# Altium schematic sheet Generic_Module.SchDoc
size C
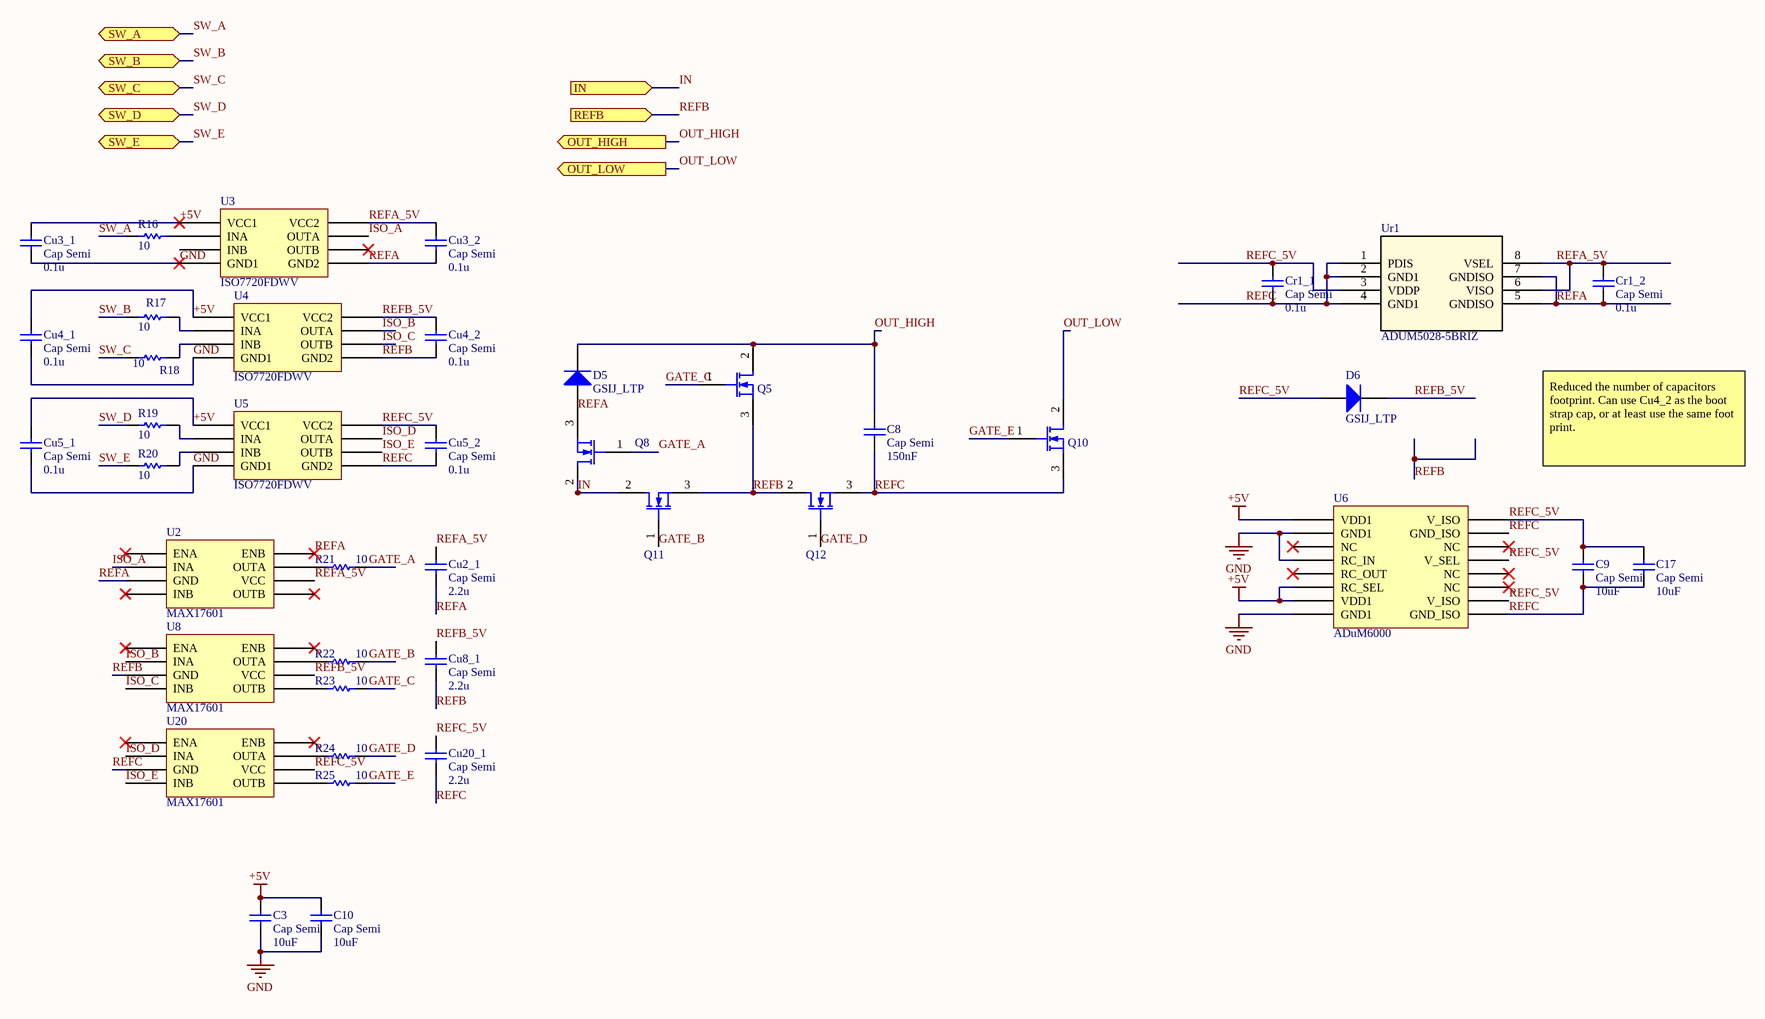
[diagram p0: Generic_Module.SchDoc]

## Parts
C3  Cap Semi  value 10uF  [1608[0603]]
C8  Cap Semi  value 150nF  [1812]
C9  Cap Semi  value 10uF  [J1-0603]
C10  Cap Semi  value 10uF  [1608[0603]]
C17  Cap Semi  value 10uF  [J1-0603]
Cr1_1  Cap Semi  value 0.1u  [J1-0603]
Cr1_2  Cap Semi  value 0.1u  [J1-0603]
Cu2_1  Cap Semi  value 2.2u  [1608[0603]]
Cu3_1  Cap Semi  value 0.1u  [C1206]
Cu3_2  Cap Semi  value 0.1u  [C1206]
Cu4_1  Cap Semi  value 0.1u  [C1206]
Cu4_2  Cap Semi  value 0.1u  [C1206]
Cu5_1  Cap Semi  value 0.1u  [C1206]
Cu5_2  Cap Semi  value 0.1u  [C1206]
Cu8_1  Cap Semi  value 2.2u  [1608[0603]]
Cu20_1  Cap Semi  value 2.2u  [1608[0603]]
D5  GSIJ_LTP  [SE30PAJ-M3]
D6  GSIJ_LTP  [SE30PAJ-M3]
Q5  IPN80R1K2P7  [SOT233-3]  (value not drawn)
Q8  IPN80R1K2P7  [SOT233-3]  (value not drawn)
Q10  IPN80R1K2P7  [SOT233-3]  (value not drawn)
Q11  IPN80R1K2P7  [SOT233-3]  (value not drawn)
Q12  IPN80R1K2P7  [SOT233-3]  (value not drawn)
R16  10  [1608[0603]]
R17  10  [1608[0603]]
R18  10  [1608[0603]]
R19  10  [1608[0603]]
R20  10  [1608[0603]]
R21  10  [1608[0603]]
R22  10  [1608[0603]]
R23  10  [1608[0603]]
R24  10  [1608[0603]]
R25  10  [1608[0603]]
U2  MAX17601  [DFN-8_DD]
U3  ISO7720FDWV  [TI_DWV]
U4  ISO7720FDWV  [TI_DWV]
U5  ISO7720FDWV  [TI_DWV]
U6  ADuM6000  [SOIC127P1030X265-16N]
U8  MAX17601  [DFN-8_DD]
U20  MAX17601  [DFN-8_DD]
Ur1  ADUM5028-5BRIZ  [RI_8_1]

## Ports
IN (in), OUT_HIGH (out), OUT_LOW (out), REFB (in), SW_A (bidir), SW_B (bidir), SW_C (bidir), SW_D (bidir), SW_E (bidir)

## Nets
+5V: C3.2 C10.2 Cu3_1.2 Cu4_1.2 Cu5_1.2 U3.1(VCC1) U4.1(VCC1) U5.1(VCC1) U6.1(VDD1) U6.6(RC_SEL) U6.7(VDD1)
GND: C3.1 C10.1 Cu3_1.1 Cu4_1.1 Cu5_1.1 U3.4(GND1) U4.4(GND1) U5.4(GND1) U6.2(GND1) U6.4(RC_IN) U6.8(GND1)
GATE_A: Q8.1 R21.2
GATE_B: Q11.1 R22.2
GATE_C: Q5.1 R23.2
GATE_D: Q12.1 R24.2
GATE_E: Q10.1 R25.2
IN: Q8.2 Q11.2 ; port IN
ISO_A: U2.2(INA) U3.7(OUTA)
ISO_B: U4.7(OUTA) U8.2(INA)
ISO_C: U4.6(OUTB) U8.4(INB)
ISO_D: U5.7(OUTA) U20.2(INA)
ISO_E: U5.6(OUTB) U20.4(INB)
OUT_HIGH: C8.2 D5.2(K) Q5.2 ; port OUT_HIGH
OUT_LOW: Q10.2 ; port OUT_LOW
REFA: Cr1_2.1 Cu2_1.1 Cu3_2.1 D5.1(A) Q8.3 U2.3(GND) U2.8(ENB) U3.5(GND2) Ur1.5(GNDISO) Ur1.7(GNDISO)
REFA_5V: Cr1_2.2 Cu2_1.2 Cu3_2.2 U2.6(VCC) U3.8(VCC2) Ur1.6(VISO) Ur1.8(VSEL)
REFB: Cu4_2.1 Cu8_1.1 Q5.3 Q11.3 Q12.2 U4.5(GND2) U8.3(GND) ; port REFB
REFB_5V: Cu4_2.2 Cu8_1.2 D6.2(K) U4.8(VCC2) U8.6(VCC)
REFC: C8.1 C9.1 C17.1 Cr1_1.1 Cu5_2.1 Cu20_1.1 Q10.3 Q12.3 U5.5(GND2) U6.9(GND_ISO) U6.15(GND_ISO) U20.3(GND) Ur1.1(PDIS) Ur1.2(GND1) Ur1.4(GND1)
REFC_5V: C9.2 C17.2 Cr1_1.2 Cu5_2.2 Cu20_1.2 D6.1(A) U5.8(VCC2) U6.10(V_ISO) U6.13(V_SEL) U6.16(V_ISO) U20.6(VCC) Ur1.3(VDDP)
SW_A: R16.2 ; port SW_A
SW_B: R17.2 ; port SW_B
SW_C: R18.1 ; port SW_C
SW_D: R19.2 ; port SW_D
SW_E: R20.2 ; port SW_E
NetR16_1: R16.1 U3.2(INA)
NetR17_1: R17.1 U4.2(INA)
NetR18_2: R18.2 U4.3(INB)
NetR19_1: R19.1 U5.2(INA)
NetR20_1: R20.1 U5.3(INB)
NetR21_1: R21.1 U2.7(OUTA)
NetR22_1: R22.1 U8.7(OUTA)
NetR23_1: R23.1 U8.5(OUTB)
NetR24_1: R24.1 U20.7(OUTA)
NetR25_1: R25.1 U20.5(OUTB)

Not connected (* = marked no-connect by the designer): U2 1(ENA)* 4(INB)* 5(OUTB)*; U3 3(INB) 6(OUTB)*; U6 3(NC)* 5(RC_OUT)* 11(NC)* 12(NC)* 14(NC)*; U8 1(ENA)* 8(ENB)*; U20 1(ENA)* 8(ENB)*

## Notes on the sheet
- Reduced the number of capacitors footprint. Can use Cu4_2 as the boot strap cap, or at least use the same foot print.
- Title
- Size:
- Date:
- File:
- C
- Number:
- Time:
- Revision:
- Sheet
- of

## Library data of the parts
C3 C8-C10 C17 Cr1_1 Cr1_2 Cu2_1 Cu3_1 Cu3_2 Cu4_1 Cu4_2 Cu5_1 Cu5_2 Cu8_1 Cu20_1 = Cap Semi: Capacitor (Semiconductor SIM Model); Published: 8-Jun-2000; LatestRevisionDate: 29-May-2009; LatestRevisionNote: IPC-7351 Footprint Added.; PackageReference: C1206; Publisher: Altium Limited; PackageDescription: Chip Capacitor
D5 D6 = SE30PAJ-M3
R16-R25 = Resistor_ST: Resistor 0402 / 0603 / 0805; Value: 10K
U6 = ADuM6000: Isolatd 5V-5V DCDC power supply
Ur1 = ADUM5028-5BRIZ: No Description Available; Copyright: Copyright (C) 2018 Accelerated Designs. All rights reserved; RefDes: RefDes; Type: DEV; Value: Value